# Altium schematic sheet ADC.SchDoc
size A4
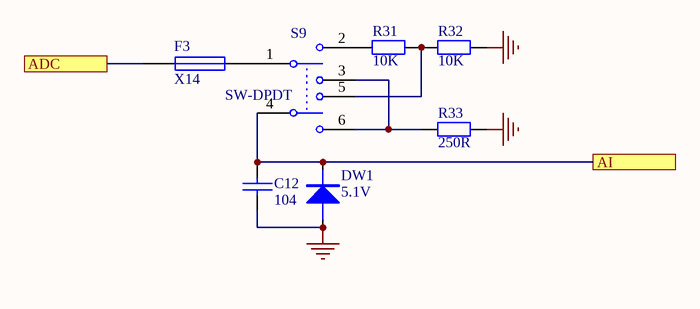
[diagram p0: ADC.SchDoc]

## Parts
C12  104  [C0805C]
DW1  5.1V  [1206AK]
F3  X14  [PPTC_SMT]
R31  10K  [0805R]
R32  10K  [0805R]
R33  250R  [0805R]
S9  SW-DPDT  [button]

## Ports
ADC, AI

## Nets
GND: C12.2 DW1.A R32.2 R33.2
ADC: F3.1 ; port ADC
AI: C12.1 DW1.K S9.4 ; port AI
NetF3_2: F3.2 S9.1
NetR31_1: R31.1 S9.2
NetR31_2: R31.2 R32.1 S9.5
NetR33_1: R33.1 S9.3 S9.6

## Library data of the parts
C12 = CAP: Capacitor
DW1 = DIODE
F3 = Fuse 1: Fuse; Published: 8-Jun-2000; LatestRevisionDate: 17-Jul-2002; LatestRevisionNote: Re-released for DXP Platform.; PackageReference: PIN-W2/E2.8; Publisher: Altium Limited
R31-R33 = Res2: Resistor; Value: 1K; Published: 8-Jun-2000; LatestRevisionDate: 17-Jul-2002; LatestRevisionNote: Re-released for DXP Platform.; PackageReference: AXIAL-0.4; Publisher: Altium Limited; PackageDescription: Axial Device, Thru-Hole; 2 Leads; 0.4 in Pin Spacing
S9 = SW-DPDT: Double-Pole, Double-Throw Switch; Published: 24-Mar-1999; LatestRevisionDate: 17-Jul-2002; LatestRevisionNote: Re-released for DXP Platform.; PackageReference: DPDT-6; Publisher: Altium Limited; PackageDescription: Switch; 6 Leads